# Altium schematic sheet Power.SchDoc: Board Level Power
size A; DrawnBy: Adam Vadala-Roth; DocumentNumber: 4; Revision: 2.4b; SheetNumber: 4; SheetTotal: 9
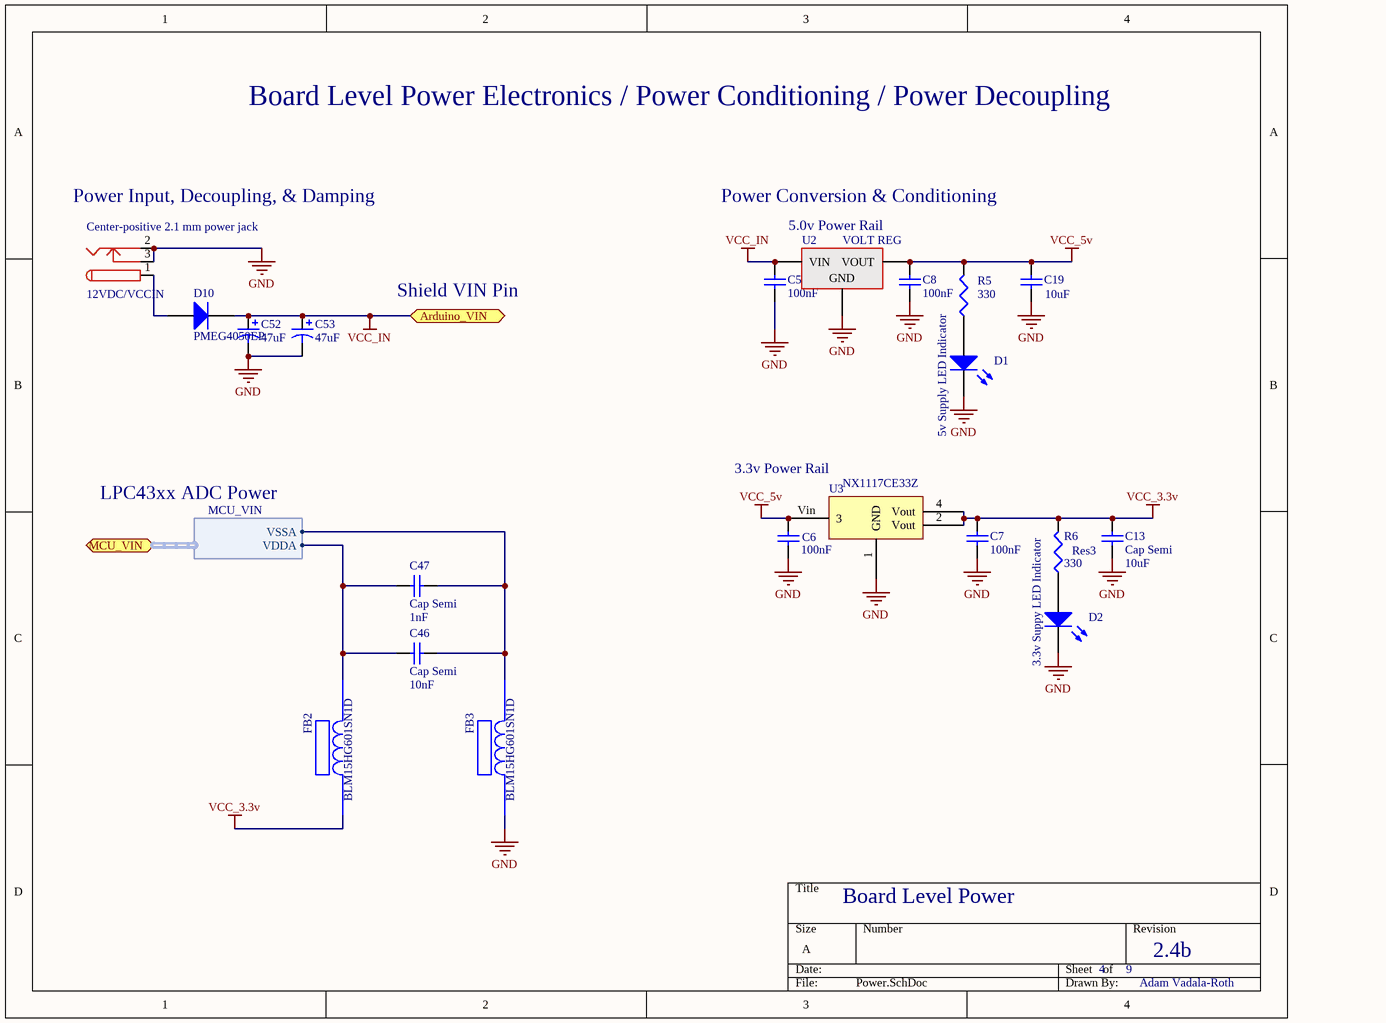
[diagram p0: Power.SchDoc]

## Parts
12VDC/VCCIN  Center-positive 2.1 mm power jack  [PJ-102AH]
C5  value 100nF  [C1206]  (hidden comment: Cap Semi)
C6  value 100nF  [C1206]  (hidden comment: Cap Semi)
C7  value 100nF  [C1206]  (hidden comment: Cap Semi)
C8  value 100nF  [C1206]  (hidden comment: Cap Semi)
C13  Cap Semi  value 10uF  [C1206]
C19  value 10uF  [C1206]  (hidden comment: Cap Semi)
C46  Cap Semi  value 10nF  [1608[0603]]
C47  Cap Semi  value 1nF  [1608[0603]]
C52  value 47uF  [CAPPR2.5-6.3x5]  (hidden comment: Cap Pol1)
C53  value 47uF  [CAPPR2.5-6.3x5]  (hidden comment: Cap Pol1)
D1  LED2  [3.2X1.6X1.1]  (value not drawn)
D2  LED2  [3.2X1.6X1.1]  (value not drawn)
D10  PMEG4050EP  [PMEG4050EP]
FB2  BLM15HG601SN1D  [BLM18PG121SN1D]
FB3  BLM15HG601SN1D  [BLM18PG121SN1D]
R5  value 330  [0805 SMD Resistor]  (hidden comment: Res3)
R6  Res3  value 330  [0805 SMD Resistor]
U2  VOLT REG  [DPAK-3]
U3  NX1117CE33Z  [NX1117CE33Z]

## Ports
Arduino_VIN, MCU_VIN (harness MCU_VIN)

## Harnesses
MCU_VIN: VDDA, VSSA

## Nets
GND: 12VDC/VCCIN.2 12VDC/VCCIN.3 C5.1 C6.1 C7.1 C8.1 C13.1 C19.1 C52.2 C53.2 D1.2(K) D2.2(K) FB3.1 U2.2(GND) U3.1(GND)
VCC_3.3v: C7.2 C13.2 FB2.1 R6.2 U3.2(Vout) U3.4(Vout)
VCC_5v: C6.2 C8.2 C19.2 R5.2 U2.3(VOUT) U3.Vin(3)
VCC_IN: C5.2 C52.1 C53.1 D10.2(K) U2.1(VIN) ; port Arduino_VIN
Net12VDC/VCCIN_1: 12VDC/VCCIN.1 D10.1(A)
NetC46_1: C46.1 C47.1 FB2.2 ; port MCU_VIN.VDDA
NetC46_2: C46.2 C47.2 FB3.2 ; port MCU_VIN.VSSA
NetD1_1: D1.1(A) R5.1
NetD2_1: D2.1(A) R6.1

## Notes on the sheet
- Board Level Power Electronics / Power Conditioning / Power Decoupling
- (near 12VDC/VCCIN) Power Input, Decoupling, & Damping
- Power Conversion & Conditioning
- 5.0v Power Rail
- Shield VIN Pin
- 5v Supply LED Indicator
- LPC43xx ADC Power
- 3.3v Power Rail
- 3.3v Suppy LED Indicator

## Library data of the parts
12VDC/VCCIN = PWR2.5: Power jack; Published: 17-Dec-2003; DatasheetDocument: 09-May-2002; Publisher: Altium Limited; ComponentLink1Description: Manufacturer Link; ComponentLink1URL: http://domino.kycon.com/internet/Products.html
C5-C8 C13 C19 C46 C47 = Cap Semi: Capacitor (Semiconductor SIM Model); Published: 8-Jun-2000; LatestRevisionDate: 29-May-2009; LatestRevisionNote: IPC-7351 Footprint Added.; PackageReference: C1206; Publisher: Altium Limited; PackageDescription: Chip Capacitor
C52 C53 = Cap Pol1: Polarized Capacitor (Radial); Published: 8-Jun-2000; LatestRevisionDate: 17-Jul-2002; LatestRevisionNote: Re-released for DXP Platform.; PackageReference: RB7.6-15; Publisher: Altium Limited; PackageDescription: Polarized Capacitor (Radial); 2 Leads
D1 D2 = LED2: Typical RED, GREEN, YELLOW, AMBER GaAs LED; Published: 8-Jun-2000; LatestRevisionDate: 17-Jul-2002; LatestRevisionNote: Re-released for DXP Platform.; PackageVersion: Feb-2002; PackageReference: 3.2X1.6X1.1; Publisher: Altium Limited; PackageDescription: SM LED; 2 Flat Leads
D10 = Diode: Default Diode; Published: 8-Jun-2000; LatestRevisionDate: 17-Jul-2002; LatestRevisionNote: Re-released for DXP Platform.; PackageVersion: Sep-1996; PackageReference: SMC; Publisher: Altium Limited; PackageDescription: DO-214-AB/SMC; 2 C-Bend Leads; Body 7.9 x 5.9 mm, inc. leads (LxW); Code_JEDEC: DO-214-AB
R5 R6 = Res3: Resistor; Published: 8-Jun-2000; LatestRevisionDate: 29-May-2009; LatestRevisionNote: IPC-7351 Footprint Added.; PackageReference: J1-0603; Publisher: Altium Limited; PackageDescription: Chip Resistor
U2 = VOLT REG: Voltage regulator; Published: 24-Mar-1999; LatestRevisionDate: 29-May-2009; LatestRevisionNote: IPC-7351 Footprint Added.; PackageReference: D2PAK; Publisher: Altium Limited; PackageDescription: 3-Pin Transistor Outline Package 2.54 mm Pitch, 15.1 mm Lead Span
U3 = NX1117CE33Z: 3.3v Linear Regulator